# EAGLE schematic sch (EAGLE 7.6.0)
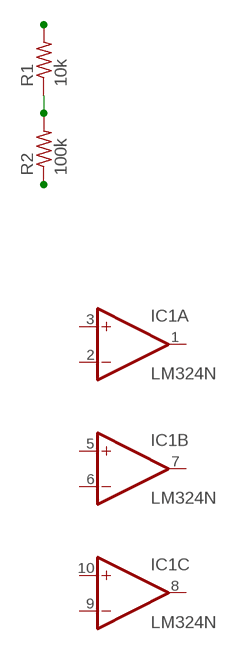
[diagram p0: schematic, sheet 1]

## Parts
IC1  LM324N  [DIL14]
R1  10k  R-US_0204/7  [0204/7]
R2  100k  R-US_0204/7  [0204/7]

## Nets
AC1_1: R1.2
AC1_2: R2.1
N$1: R1.1 R2.2
Unconnected: IC1.1(A:OUT) IC1.2(A:-IN) IC1.3(A:+IN) IC1.5(B:+IN) IC1.6(B:-IN) IC1.7(B:OUT) IC1.8(C:OUT) IC1.9(C:-IN) IC1.10(C:+IN) IC1.12(D:+IN) IC1.13(D:-IN) IC1.14(D:OUT)

## Power pins joined to a net without a drawn wire
V+: IC1.4(P:V+)
V-: IC1.11(P:V-)

## Library data of the parts
IC1 = linear:LM324: OP AMP
R1 R2 = rcl:R-US_: RESISTOR, American symbol